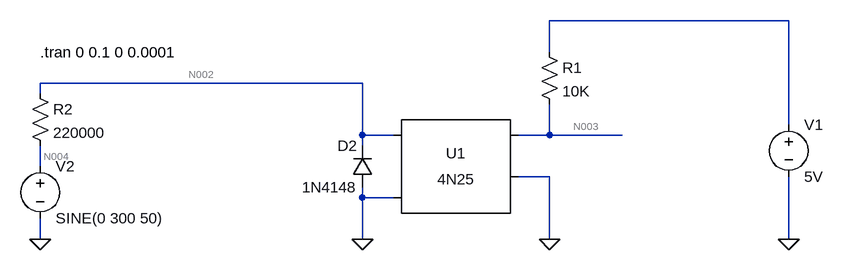
[diagram p0: schematic Spannungspruefung.asc]
Spannungspruefung.asc, the LTspice schematic file:
Version 4
SHEET 1 1448 680
WIRE 1392 -80 1024 -80
WIRE 1024 -32 1024 -80
WIRE 736 16 240 16
WIRE 240 32 240 16
WIRE 1392 80 1392 -80
WIRE 736 96 736 16
WIRE 784 96 736 96
WIRE 1024 96 1024 48
WIRE 1024 96 976 96
WIRE 1136 96 1024 96
WIRE 736 112 736 96
WIRE 240 144 240 112
WIRE 1024 160 976 160
WIRE 736 192 736 176
WIRE 784 192 736 192
WIRE 240 256 240 224
WIRE 736 256 736 192
WIRE 1024 256 1024 160
WIRE 1392 256 1392 160
FLAG 240 256 0
FLAG 736 256 0
FLAG 1024 256 0
FLAG 1392 256 0
SYMBOL voltage 240 128 R0
WINDOW 123 0 0 Left 0
WINDOW 39 0 0 Left 0
SYMATTR InstName V2
SYMATTR Value SINE(0 300 50)
SYMBOL res 224 16 R0
SYMATTR InstName R2
SYMATTR Value 220000
SYMBOL Optos\\4N25 880 160 R0
SYMATTR InstName U1
SYMBOL diode 752 176 R180
WINDOW 0 24 64 Left 2
WINDOW 3 24 0 Left 2
SYMATTR InstName D2
SYMATTR Value 1N4148
SYMBOL res 1008 -48 R0
SYMATTR InstName R1
SYMATTR Value 10K
SYMBOL voltage 1392 64 R0
WINDOW 123 0 0 Left 0
WINDOW 39 0 0 Left 0
SYMATTR InstName V1
SYMATTR Value 5V
TEXT 240 -32 Left 2 !.tran 0 0.1 0 0.0001

The netlist it stands for:
* Spannungspruefung.asc
V2 N004 0 SINE(0 300 50)
R2 N002 N004 220000
XU1 N002 0 N003 0 NC_01 4N25
D2 0 N002 1N4148
R1 N001 N003 10K
V1 N001 0 5V
.model D D
.lib standard.dio
.tran 0 0.1 0 0.0001
.lib 4N25.sub
.backanno
.end

* Results of the author's LTspice run, read from the files saved beside the schematic
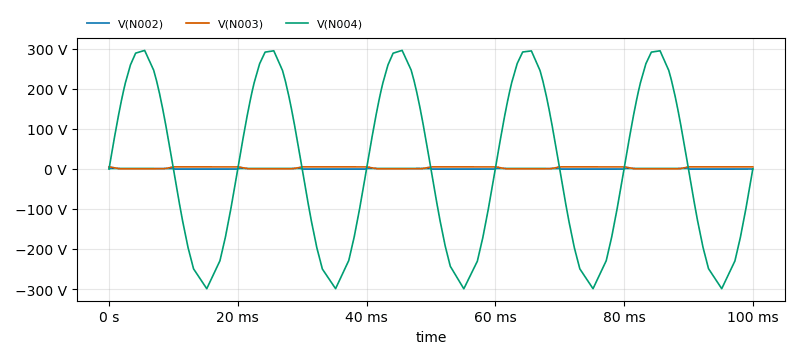
[diagram p1: Transient Analysis of Spannungspruefung.asc, plotted from the saved traces]
* Transient Analysis, 1 run:
*   V(N002): min -599 mV, max 1.023 V, average 219 mV, rms 814.7 mV, last -191.3 mV
*   V(N003): min 155.9 mV, max 5 V, average 2.968 V, rms 3.731 V, last 5 V
*   V(N004): min -299.5 V, max 295.9 V, average 1.477 V, rms 209 V, last 0 V